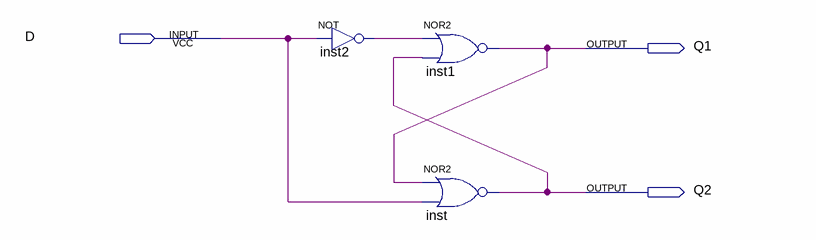
[diagram p0: schematic sheet]
// Quartus schematic latch_D.bdf as structural Verilog: 3 symbols, 3 pins
module latch_D (
  input  D,
  output Q1,
  output Q2
);

  wire inst2_out;

  not inst2 (inst2_out, D);
  nor inst1 (Q1, inst2_out, Q2);
  nor inst (Q2, Q1, D);
endmodule
